# EAGLE design DobbelSteen_with_programing_header_revision_3 (EAGLE 6.5.0)
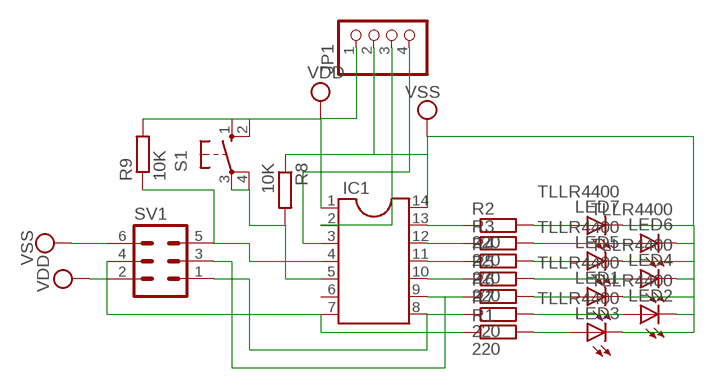
[diagram p0: schematic, sheet 1]

## Parts
IC1  DIL14S  [SOCKET-14]
JP1  PINHD-1X4  [1X04]
LED1  TLLR4400  [LED3MM]
LED2  TLLR4400  [LED3MM]
LED3  TLLR4400  [LED3MM]
LED4  TLLR4400  [LED3MM]
LED5  TLLR4400  [LED3MM]
LED6  TLLR4400  [LED3MM]
LED7  TLLR4400  [LED3MM]
R1  220  R0204/7  [0204/7]
R2  220  R0204/7  [0204/7]
R3  220  R0204/7  [0204/7]
R4  220  R0204/7  [0204/7]
R5  220  R0204/7  [0204/7]
R6  R0204/7  [0204/7]
R7  220  R0204/7  [0204/7]
R8  10K  R0204/7  [0204/7]
R9  10K  R0204/7  [0204/7]
S1  10-XX  [B3F-10XX]
SV1  MA03-2  [MA03-2]

## Nets
N$1: IC1.13 R2.1
N$2: IC1.12 R3.1
N$3: IC1.11 R4.1
N$4: IC1.10 R5.1
N$6: IC1.8 R7.1 SV1.1
N$8: LED7.A R2.2
N$9: LED6.A R3.2
N$10: LED5.A R4.2
N$11: LED4.A R5.2
N$12: LED1.A R6.2
N$13: LED2.A R7.2
N$14: LED3.A R1.2
N$15: IC1.7 R1.1 SV1.4
N$16: IC1.2 JP1.3
N$17: IC1.4 R9.1 SV1.5
N$18: IC1.3 JP1.4
N$19: IC1.9 R6.1 SV1.3
N$20: IC1.5 R8.2 S1.3(P) S1.4(P1)
VDD: IC1.1 JP1.1 R9.2 S1.1(S) S1.2(S1) SV1.2
VSS: IC1.14 JP1.2 LED1.K(C) LED2.K(C) LED3.K(C) LED4.K(C) LED5.K(C) LED6.K(C) LED7.K(C) R8.1 SV1.6
Unconnected: IC1.6

## Library data of the parts
IC1 = ic-package:DIL14: Dual In Line / Socket
JP1 = pinhead:PINHD-1X4: PIN HEADER
LED1-LED7 = led:TLLR4400: Low Current (2mA) LED 3 mm Tinted Diffused Package color RED Source: Data sheet <http://www.farnell.com/datasheets/391100.pdf>; MF: VISHAY SEMICONDUCTOR; OC_FARNELL: 1612437
R1-R9 = eagle-ltspice:R: RESISTOR, European symbol; SPICEMODEL: NONE; SPICEPREFIX: R
S1 = switch-omron:10-XX: OMRON SWITCH; MPN: B3F-1000; OC_FARNELL: 176432; OC_NEWARK: 36M3542
SV1 = con-lstb:MA03-2: PIN HEADER; OC_FARNELL: unknown; OC_NEWARK: unknown

## Board
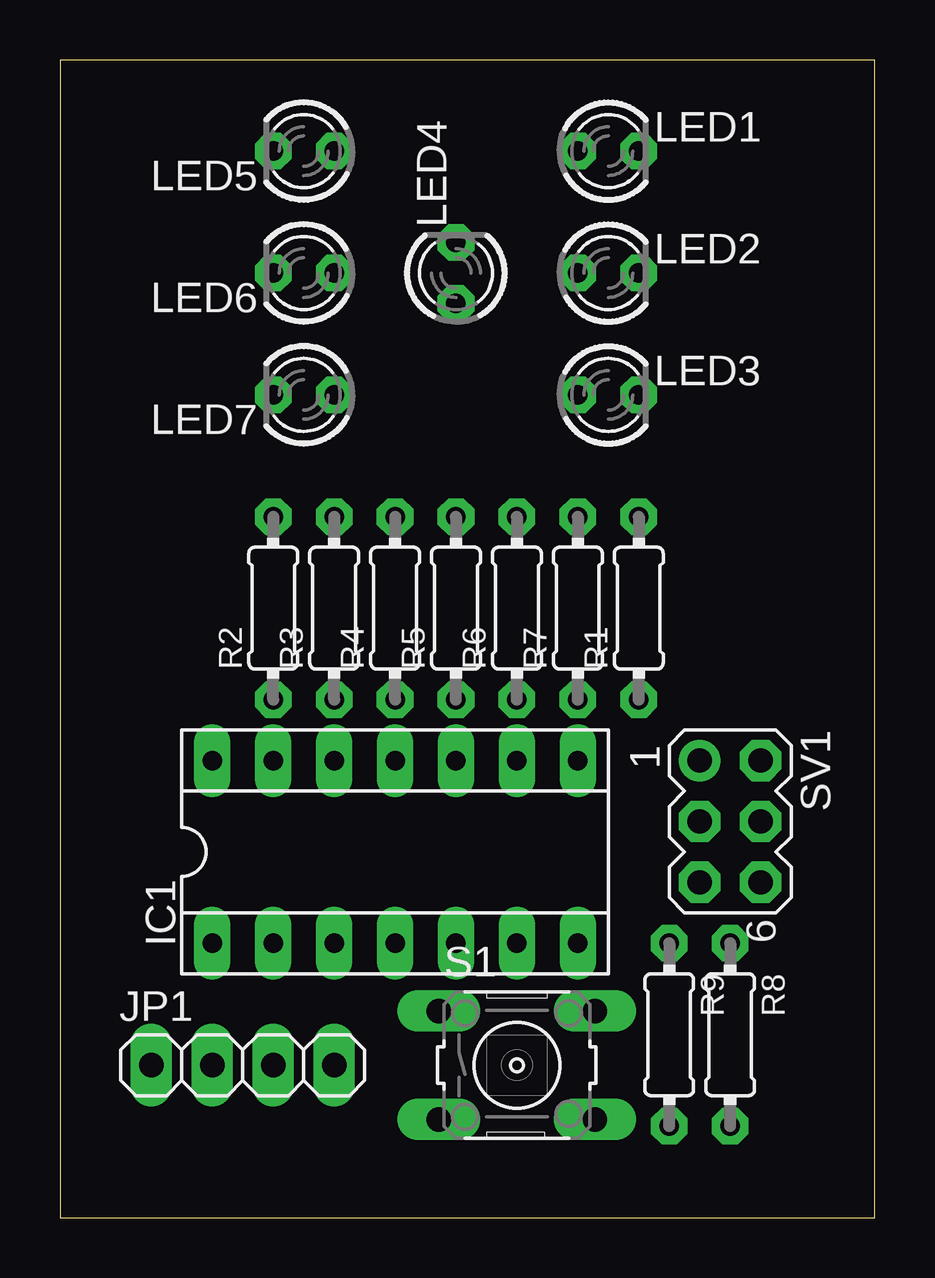
[diagram p1: board, top side]
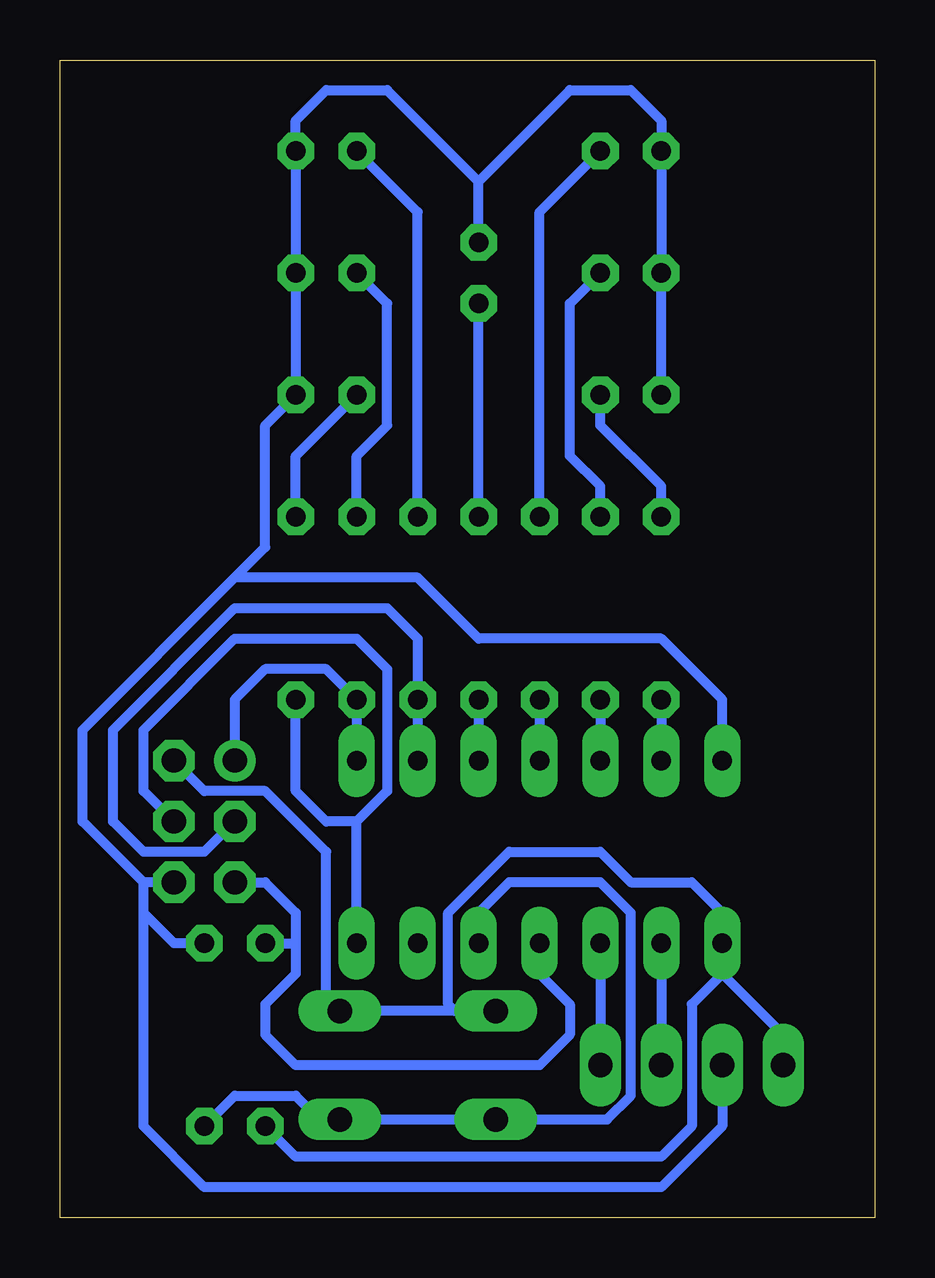
[diagram p2: board, bottom side, seen from below]

Size 33.96 x 48.25 mm. Coordinates in mm from the lower left corner, seen from the top.
Outline: 0,0 33.96,0 33.96,48.25 0,48.25 0,0
Copper layers (1*16): Top 0.035mm / dielectric 1.5mm / Bottom 0.035mm
Design rules "default *": minimum track width 10mil, minimum drill 24mil, track to track 8mil, track to pad 8mil, pad to pad 8mil, via to via 8mil, smd to smd 8mil, copper to edge 40mil, drill to drill 8mil, minimum pad ring 14mil, minimum via ring 8mil, stop-mask expansion 4mil, vias tented up to drill 0mil, thermal gap 10mil

### Footprints (pad centres in the part's own frame; a part is rotated, then mirrored left to right if it is on the bottom)
SOCKET-14 = drill 0.813 long: 1 -7.62,-3.81; 2 -5.08,-3.81; 3 -2.54,-3.81; 4 0,-3.81; 5 2.54,-3.81; 6 5.08,-3.81; 7 7.62,-3.81; 8 7.62,3.81; 9 5.08,3.81; 10 2.54,3.81; 11 0,3.81; 12 -2.54,3.81; 13 -5.08,3.81; 14 -7.62,3.81
1X04 = drill 1.016 long: 1 -3.81,0; 2 -1.27,0; 3 1.27,0; 4 3.81,0
LED3MM = drill 0.813 octagon: A -1.27,0; K 1.27,0
0204/7 = drill 0.813 octagon: 1 -3.81,0; 2 3.81,0
B3F-10XX = drill 1.016 long: 1 -3.251,2.261; 2 3.251,2.261; 3 -3.251,-2.261; 4 3.251,-2.261
MA03-2 = drill 1.016: 1 -2.54,-1.27 | drill 1.016 octagon: 2 -2.54,1.27; 3 0,-1.27; 4 0,1.27; 5 2.54,-1.27; 6 2.54,1.27

### Placement (x,y rotation side)
IC1  13.97,15.24 0 top
JP1  7.62,6.35 0 top
LED1  22.86,44.45 0 top
LED2  22.86,39.37 0 top
LED3  22.86,34.29 0 top
LED4  16.51,39.37 90 top
LED5  10.16,44.45 180 top
LED6  10.16,39.37 180 top
LED7  10.16,34.29 180 top
R1  24.13,25.4 90 top
R2  8.89,25.4 90 top
R3  11.43,25.4 90 top
R4  13.97,25.4 90 top
R5  16.51,25.4 90 top
R6  19.05,25.4 90 top
R7  21.59,25.4 90 top
R8  27.94,7.62 270 top
R9  25.4,7.62 270 top
S1  19.05,6.35 0 top
SV1  27.94,16.51 270 top

### Tracks (layer width: path | path; a pad name or v marks a point on that pad's centre or on a via)
N$1
  Bottom 0.406: R2.1 IC1.13
N$2
  Bottom 0.406: R3.1 IC1.12
N$3
  Bottom 0.406: R4.1 IC1.11
N$4
  Bottom 0.406: R5.1 IC1.10
N$6
  Bottom 0.406: SV1.1 26.67,21.59 25.4,22.86 22.86,22.86 R7.1 IC1.8
N$8
  Bottom 0.406: R2.2 8.89,30.48 11.43,33.02 LED7.A
N$9
  Bottom 0.406: R3.2 11.43,30.48 12.7,31.75 12.7,38.1 LED6.A
N$10
  Bottom 0.406: R4.2 13.97,41.91 LED5.A
N$11
  Bottom 0.406: R5.2 LED4.A
N$12
  Bottom 0.406: R6.2 19.05,41.91 LED1.A
N$13
  Bottom 0.406: R7.2 21.59,31.75 20.32,33.02 20.32,38.1 LED2.A
N$14
  Bottom 0.406: R1.2 24.13,31.75 LED3.A
N$15
  Bottom 0.406: SV1.4 30.48,17.78 30.48,20.32 26.67,24.13 21.59,24.13 20.32,22.86 20.32,17.78 21.59,16.51 | 21.59,16.51 22.86,16.51 24.13,17.78 R1.1 | IC1.7 21.59,16.51
N$16
  Bottom 0.406: IC1.2 JP1.3
N$17
  Bottom 0.406: SV1.5 25.4,13.97 24.13,12.7 24.13,11.43 | 24.13,11.43 24.13,10.16 25.4,8.89 25.4,7.62 24.13,6.35 13.97,6.35 12.7,7.62 12.7,8.89 13.97,10.16 IC1.4 | R9.1 24.13,11.43
N$18
  Bottom 0.406: IC1.3 JP1.4
N$19
  Bottom 0.406: SV1.3 27.94,15.24 30.48,15.24 31.75,16.51 31.75,20.32 26.67,25.4 20.32,25.4 19.05,24.13 R6.1 IC1.9
N$20
  Bottom 0.406: IC1.5 16.51,12.7 15.24,13.97 11.43,13.97 10.16,12.7 10.16,5.08 11.15,4.09 S1.3 S1.4 23.14,4.09 24.13,5.08 26.67,5.08 R8.2
VDD
  Bottom 0.406: SV1.2 27.94,17.78 25.4,17.78 22.86,15.24 22.86,8.89 22.58,8.61 S1.2 S1.1 17.5,8.61 17.78,8.89 17.78,12.7 15.24,15.24 11.43,15.24 10.16,13.97 7.62,13.97 6.35,12.7 IC1.1 6.35,10.16 | JP1.1 3.81,7.62 6.35,10.16 | 6.35,10.16 7.62,8.89 7.62,3.81 8.89,2.54 24.13,2.54 R9.2
VSS
  Bottom 0.406: SV1.6 30.48,13.97 | 30.48,13.97 33.02,16.51 33.02,20.32 26.67,26.67 | 26.67,26.67 25.4,27.94 25.4,33.02 LED3.K LED2.K LED1.K 24.13,45.72 22.86,46.99 20.32,46.99 16.51,43.18 | LED7.K LED6.K LED5.K 8.89,45.72 10.16,46.99 12.7,46.99 16.51,43.18 | LED4.K 16.51,43.18 | JP1.2 6.35,3.81 8.89,1.27 27.94,1.27 30.48,3.81 30.48,12.7 | 30.48,12.7 30.48,13.97 | R8.1 29.21,11.43 30.48,12.7 | IC1.14 6.35,21.59 8.89,24.13 16.51,24.13 19.05,26.67 26.67,26.67